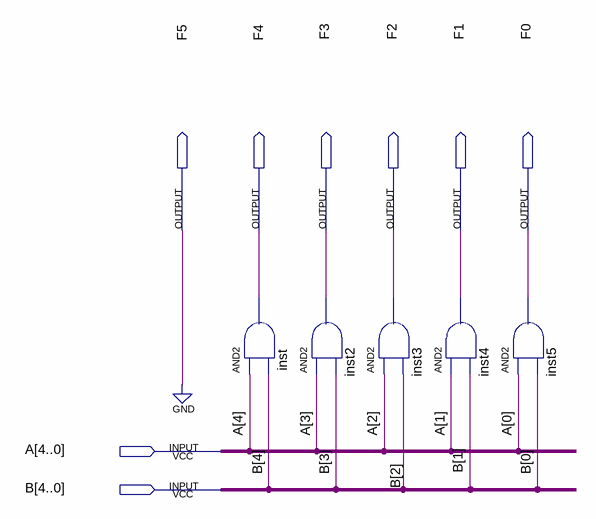
[diagram p0: schematic sheet]
// Quartus schematic PortAND.bdf as structural Verilog: 5 symbols, 8 pins
module PortAND (
  input  [4:0] A,
  input  [4:0] B,
  output F5,
  output F4,
  output F3,
  output F2,
  output F1,
  output F0
);

  and inst (F4, A[4], B[4]);
  and inst2 (F3, A[3], B[3]);
  and inst3 (F2, A[2], B[2]);
  and inst4 (F1, A[1], B[1]);
  and inst5 (F0, A[0], B[0]);

  assign F5 = 1'b0;
endmodule
